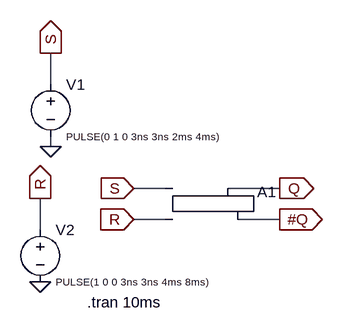
[diagram p0: schematic Bascule.asc]
Bascule.asc, the LTspice schematic file:
Version 4
SHEET 1 880 680
WIRE -48 0 -48 -48
WIRE -48 96 -48 80
WIRE 128 160 80 160
WIRE 304 160 224 160
WIRE 128 208 80 208
WIRE 304 208 240 208
WIRE -64 224 -64 176
FLAG -48 96 0
FLAG -64 304 0
FLAG 304 160 Q
IOPIN 304 160 Out
FLAG 304 208 #Q
IOPIN 304 208 Out
FLAG -48 -48 S
IOPIN -48 -48 Out
FLAG -64 176 R
IOPIN -64 176 Out
FLAG 80 160 S
IOPIN 80 160 In
FLAG 80 208 R
IOPIN 80 208 In
SYMBOL Digital\\srflop 176 112 R0
SYMATTR InstName A1
SYMBOL voltage -48 -16 R0
WINDOW 3 24 96 Left 1
WINDOW 123 0 0 Left 0
WINDOW 39 0 0 Left 0
SYMATTR Value PULSE(0 1 0 3ns 3ns 2ms 4ms)
SYMATTR InstName V1
SYMBOL voltage -64 208 R0
WINDOW 3 24 96 Left 1
WINDOW 123 0 0 Left 0
WINDOW 39 0 0 Left 0
SYMATTR Value PULSE(1 0 0 3ns 3ns 4ms 8ms)
SYMATTR InstName V2
TEXT 8 336 Left 2 !.tran 10ms

The netlist it stands for:
* Bascule.asc
A1 S R 0 0 0 #Q Q 0 SRFLOP
V1 S 0 PULSE(0 1 0 3ns 3ns 2ms 4ms)
V2 R 0 PULSE(1 0 0 3ns 3ns 4ms 8ms)
.tran 10ms
.backanno
.end